# Altium schematic sheet connector1.SchDoc
size A4; SheetNumber: 4; SheetTotal: 6
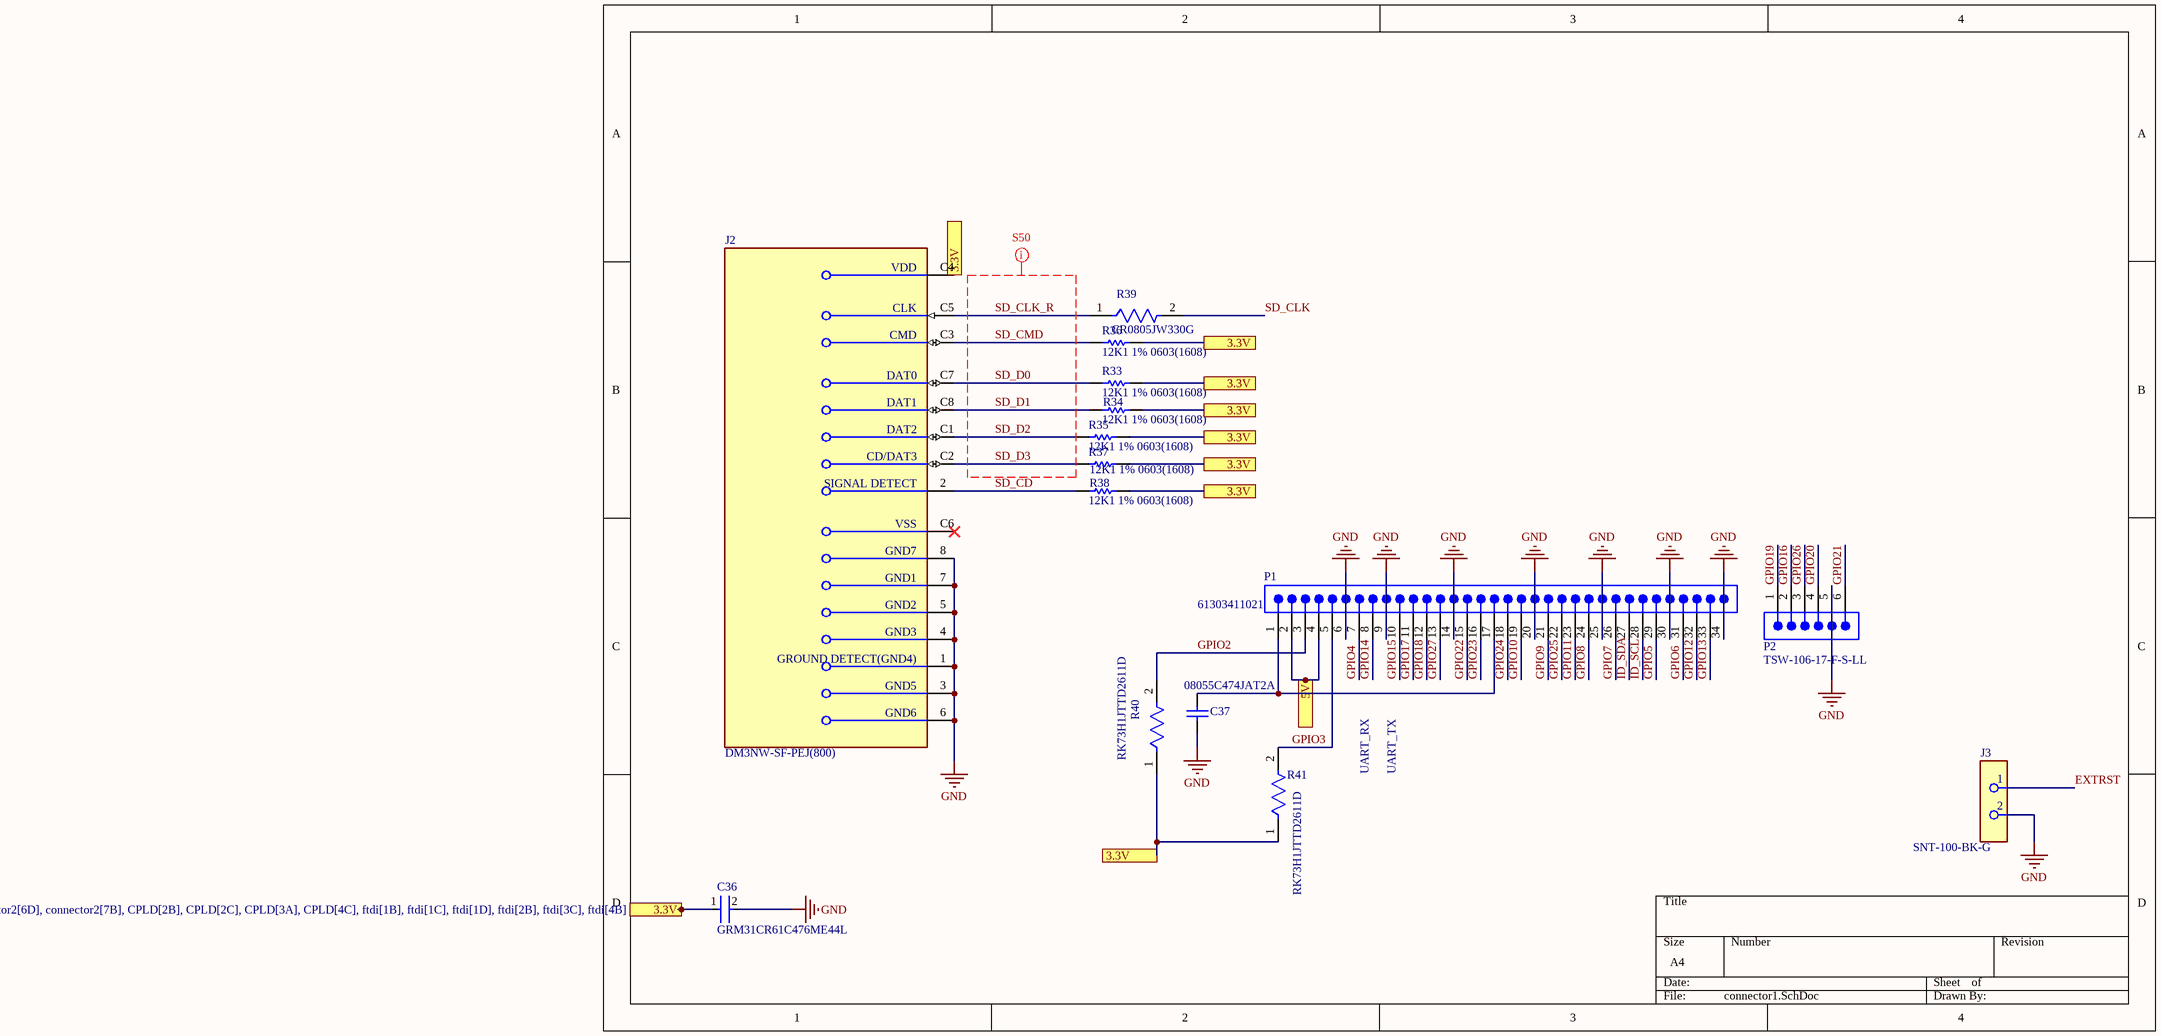
[diagram p0: connector1.SchDoc]

## Parts
C36  GRM31CR61C476ME44L  [FP-GRM31C-0_3-e0_3_0_8-IPC_C]
C37  08055C474JAT2A  [CAPC2013X140X50ML20T25]
J2  DM3NW-SF-PEJ(800)  [FP-DM3NW-SF-PEJ_800-MFG]
J3  SNT-100-BK-G  [FP-SNT-100-BK-G-MFG]  (no BOM)
P1  61303411021  [61303411021]
P2  TSW-106-17-F-S-LL  [SMTC-TSW-106-17-X-S-LL]
R33  12K1 1% 0603(1608)  [RESC0603(1608)_M]
R34  12K1 1% 0603(1608)  [RESC0603(1608)_M]
R35  12K1 1% 0603(1608)  [RESC0603(1608)_M]
R36  12K1 1% 0603(1608)  [RESC0603(1608)_M]
R37  12K1 1% 0603(1608)  [RESC0603(1608)_M]
R38  12K1 1% 0603(1608)  [RESC0603(1608)_M]
R39  CR0805JW330G  [FP-CR0805-IPC_C]
R40  RK73H1JTTD2611D  [FP-RK73H1J-IPC_B]
R41  RK73H1JTTD2611D  [FP-RK73H1J-IPC_B]

## Ports
3.3V (see connector1[1B], connector1[1D], connector1[2B], connector1[2D], connector2[1B], connector2[3A], connector2[4A], connector2[4C], connector2[4D], connector2[5C], connector2[6B], connector2[6D], connector2[7B], CPLD[2B], CPLD[2C], CPLD[3A], CPLD[4C], ftdi[1B], ftdi[1C], ftdi[1D], ftdi[2B], ftdi[3C], ftdi[4B]), 3.3V (see connector1[1B], connector1[1D], connector1[2B], connector2[1B], connector2[3A], connector2[4A], connector2[4C], connector2[4D], connector2[5C], connector2[6B], connector2[6D], connector2[7B], CPLD[2B], CPLD[2C], CPLD[3A], CPLD[4C], ftdi[1B], ftdi[1C], ftdi[1D], ftdi[2B], ftdi[3C], ftdi[4B]), 3.3V (see connector1[1B], connector1[2B], connector1[2D], connector2[1B], connector2[3A], connector2[4A], connector2[4C], connector2[4D], connector2[5C], connector2[6B], connector2[6D], connector2[7B], CPLD[2B], CPLD[2C], CPLD[3A], CPLD[4C], ftdi[1B], ftdi[1C], ftdi[1D], ftdi[2B], ftdi[3C], ftdi[4B]), 3.3V (see connector1[1D], connector1[2B], connector1[2D], connector2[1B], connector2[3A], connector2[4A], connector2[4C], connector2[4D], connector2[5C], connector2[6B], connector2[6D], connector2[7B], CPLD[2B], CPLD[2C], CPLD[3A], CPLD[4C], ftdi[1B], ftdi[1C], ftdi[1D], ftdi[2B], ftdi[3C], ftdi[4B]), 5V

## Nets
GND: C36.2 C37.1 J2.1(GROUND_DETECT(GND4)) J2.3(GND5) J2.4(GND3) J2.5(GND2) J2.6(GND6) J2.7(GND1) J2.8(GND7) P1.6 P1.9 P1.14 P1.20 P1.25 P1.30 P1.34 P2.5
3.3V: C36.1 J2.C4(VDD) R33.2 R34.2 R35.2 R36.2 R37.2 R38.2 R40.1 R41.1 ; port 3.3V
5V: P1.2 P1.4 ; port 5V
GPIO2: P1.3 R40.2
GPIO3: P1.5 R41.2
GPIO4: P1.7
GPIO5: P1.29
GPIO6: P1.31
GPIO7: P1.26
GPIO8: P1.24
GPIO9: P1.21
GPIO10: P1.19
GPIO11: P1.23
GPIO12: P1.32
GPIO13: P1.33
GPIO14: P1.8
GPIO15: P1.10
GPIO16: P2.2
GPIO17: P1.11
GPIO18: P1.12
GPIO19: P2.1
GPIO20: P2.4
GPIO21: P2.6
GPIO22: P1.15
GPIO23: P1.16
GPIO24: P1.18
GPIO25: P1.22
GPIO26: P2.3
GPIO27: P1.13
ID_SCL: P1.28
ID_SDA: P1.27
SD_CD: J2.2(SIGNAL_DETECT) R38.1
SD_CLK: R39.2
SD_CLK_R: J2.C5(CLK) R39.1
SD_CMD: J2.C3(CMD) R36.1
SD_D0: J2.C7(DAT0) R33.1
SD_D1: J2.C8(DAT1) R34.1
SD_D2: J2.C1(DAT2) R35.1
SD_D3: J2.C2(CD/DAT3) R37.1
NetC37_2: C37.2 P1.1 P1.17

Not connected (* = marked no-connect by the designer): J2 C6(VSS)*

## Layout directives
mark named S50: SD_CLK_R, SD_CMD, SD_D0, SD_D1, SD_D2, SD_D3

## Notes on the sheet
- UART_RX
- UART_TX

## Library data of the parts
C36 = CMP-06035-011430-1: Chip Multilayer Ceramic Capacitors for General Purpose, 1206, 47uF, X5R, 15%, 20%, 16V; Capacitance: 47uF; Length: 3.2mm; Thickness: 1.6mm; Width: 1.6mm; Voltage Rating (DC): 16V; Tolerance: 20%; Dielectric: X5R
C37 = CMP-2007-04634-1: Manufacturer: AVX Interconnect / Elco; Part Number: 08055C474JAT2A
J2 = CMP-11597-000007-1: CONN MICROSD CARD PUSH-PUSH SMD; RoHS Compliant: Yes
J3 = CMP-02752-000005-1: CONN SHUNT 2POS; Number of Positions: 2; Max Current Rating: 2.5A; Pitch: 2.54mm; Contact Resistance: 5mR; Min Operating Temperature: -55°C; Number of Rows: 1; Housing Color: Black; Package Quantity: 1; Depth: 2.54mm; Housing Material: Polyester; Series: SNT; RoHS Compliant: Yes; Orientation: Straight; Radiation Hardening: No; Number of Contacts: 2; REACH SVHC: No SVHC; Length: 5.08mm; Contact Plating: Gold; Max Operating Temperature: 125°C; Color: Black; Packaging: Bulk; Height: 0.24inch; Contact Material: Bronze
P1 = CMP-1502-01125-3: NexarPartId: 32855570; Contact Resistance: 20mΩ; Operating Supply Voltage: 250V; Current Rating: 3A; Number of Contacts: 34; Connector Type: Male Pin; Gender: Male; Pitch: 2.54mm; Mount: Through Hole; Contact Material: Copper; Packaging: Bulk; Color: Black; Number of Rows: 1; RoHS: Compliant; Contact Plating: Gold; Lead Pitch: 2.54mm; Number of Pins: 34; Number of Positions: 34; REACH SVHC: Unknown; Contact Mating Length: 5.9944mm; Termination: Solder
P2 = CMP-1024-00393-1: 0.025" SQ Post Header, Through-hole, Vertical, -55 to 125 degC, 2.54 mm Pitch, 6-Pin, Male, RoHS; Manufacturer: Samtec; Pitch: 2.54 mm; PackageReference: TSW-106-17-X-S-LL; ComponentLink3Description: Package Specification; PackageVersion: DM, 8/1988; ComponentLink2Description: Datasheet; ComponentLink1URL: http://www.samtec.com; Mounting Technology: Through-hole; ComponentLink3URL: http://www.samtec.com/documents/webfiles/cpdf/TSW-XXX-XX-XXX-X-XX-XXX-MKT.pdf; ComponentLink1Description: Manufacturer URL; RoHS: True; ComponentLink2URL: http://www.samtec.com/documents/webfiles/pdf/TSW_TH.PDF; Orientation: Vertical; Temperature Range: -55 to 125 degC; DatasheetVersion: F-214; PackageDescription: .025[0.64] SQ. Post Terminal Strip Assembly; PartNumber: TSW-106-17-F-S-LL
R33-R38 = CMP-1012-00632-1: 12K1 0.1W 1% 0603 (1608 Metric)  SMD; Case-Metric: 1608; Case-EIA: 0603; Value: 12100.00 Ohm; Power: 0.1 W; Technology: SMT; Tolerance: 1 %
R39 = CMP-07231-004924-1: Thick Film Chip Resistors 0805 33Ω 0.125W 5% 200ppm/°C; Power Rating: 125mW; Resistance: 33R; Voltage Rating: 150V; Width: 1.25mm; Temperature Coefficient: 200ppm/°C; Case Code (Metric): 2012; Case Code (Imperial): 0805; Termination: SMD/SMT; Height: 0.5mm; Max Operating Temperature: 155°C; Case/Package: 0805; Thickness: 508um; Packaging: Tape and Reel; Min Operating Temperature: -55°C; Length: 2mm; Package Quantity: 10000; Tolerance: 5%
R40 R41 = CMP-04015-095862-1: 2.61kΩ ±0.5% 0.1W Chip Resistor 0603 Thick Film AEC-Q200 Qualified